# EAGLE design Ethernet Phy 4 esp32 (EAGLE 9.3.2)
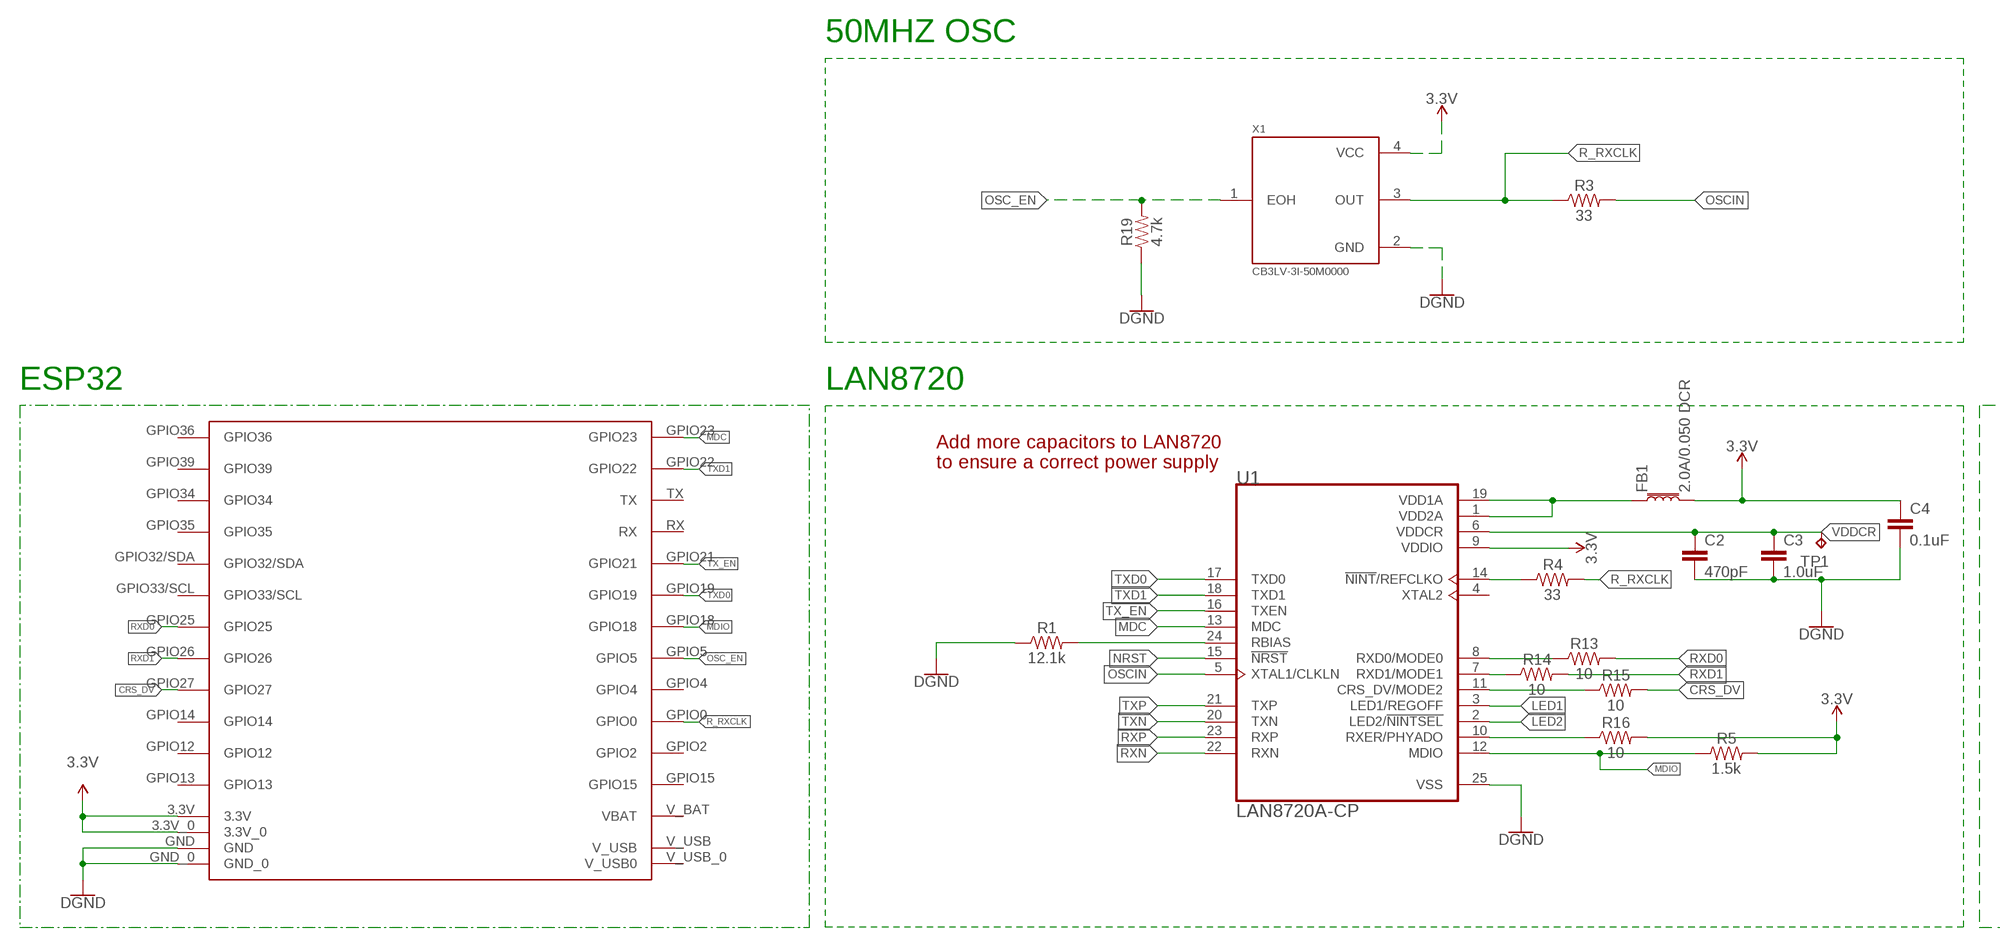
[diagram p0: schematic, sheet 1, part 1 of 2]
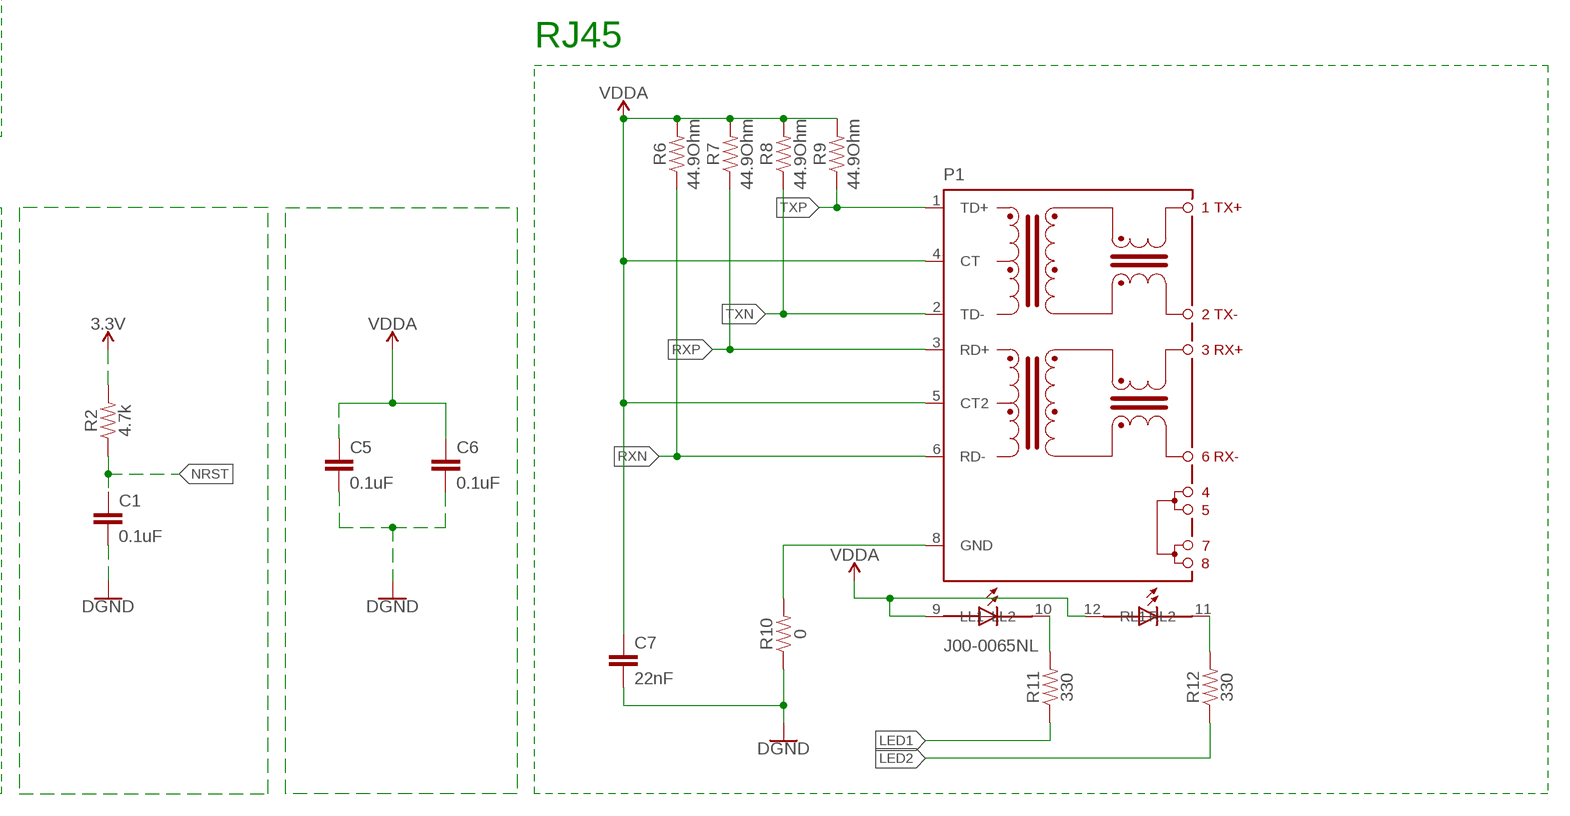
[diagram p1: schematic, sheet 1, part 2 of 2]

## Parts
C1  0.1uF  0.1UF-0603-100V-10%  [0603]
C2  470pF  470PF-0603-50V-5%  [0603]
C3  1.0uF  1.0UF-0603-16V-10%  [0603]
C4  0.1uF  0.1UF-0603-100V-10%  [0603]
C5  0.1uF  0.1UF-0603-25V-(+80/-20%)  [0603]
C6  0.1uF  0.1UF-0603-25V-(+80/-20%)  [0603]
C7  22nF  22NF/22,000PF-0603-50V-10%  [0603]
FB1  2.0A/0.050 DCR  FERRITE_BEAD-0603  [0603]
P1  J00-0065NL  [PULSE_J00-0065NL]
R1  12.1k  12.1KOHM-0603-1/10W-1%  [0603]
R2  4.7k  4.7KOHM-0603-1/10W-1%  [0603]
R3  33  33OHM-0603-1/10W-1%  [0603]
R4  33  33OHM-0603-1/10W-1%  [0603]
R5  1.5k  1.5KOHM-0603-1/10W-1%  [0603]
R6  44.9Ohm  43KOHM-0603-1/10W-1%  [0603]
R7  44.9Ohm  43KOHM-0603-1/10W-1%  [0603]
R8  44.9Ohm  43KOHM-0603-1/10W-1%  [0603]
R9  44.9Ohm  43KOHM-0603-1/10W-1%  [0603]
R10  0  0OHM-0603-1/10W-5%  [0603]
R11  330  330OHM-0603-1/10W-1%  [0603]
R12  330  330OHM-0603-1/10W-1%  [0603]
R13  10  10OHM-0603-1/10W-1%  [0603]
R14  10  10OHM-0603-1/10W-1%  [0603]
R15  10  10OHM-0603-1/10W-1%  [0603]
R16  10  10OHM-0603-1/10W-1%  [0603]
R19  4.7k  4.7KOHM-0603-1/10W-1%  [0603]
TP1  TPB1,27  [B1,27]
U1  LAN8720A-CP  [QFN50P400X400X100-25N]
U$4  OSIBOARD  [OSIBOARD]
X1  CB3LV-3I-50M0000  [OSCCC700X500X180-4N]

## Nets
3.3V: C4.1 FB1.2 R2.2 R5.2 R16.2 U1.9(VDDIO) U$4.3.3V U$4.3.3V_0 X1.4(VCC)
CRS_DV: R15.2 U$4.GPIO27
GND: C1.2 C2.2 C3.2 C4.2 C5.2 C6.2 C7.2 R1.1 R10.1 R19.1 U1.25(VSS) U$4.GND U$4.GND_0 X1.2(GND) ; supply symbol labelled DGND
LED1: R11.1 U1.3(LED1/REGOFF)
LED2: R12.1 U1.2(LED2/!NINTSEL!)
MDC: U1.13(MDC) U$4.GPIO23
MDIO: R5.1 U1.12(MDIO) U$4.GPIO18
N$4: R1.2 U1.24(RBIAS)
N$7: R4.1 U1.14(!NINT!/REFCLKO)
N$8: FB1.1 U1.1(VDD2A) U1.19(VDD1A)
N$10: P1.10(LL2) R11.2
N$12: P1.8(GND) R10.2
N$13: P1.11(RL2) R12.2
N$14: R14.1 U1.7(RXD1/MODE1)
N$15: R13.1 U1.8(RXD0/MODE0)
N$16: R15.1 U1.11(CRS_DV/MODE2)
N$17: R16.1 U1.10(RXER/PHYADO)
NRST: C1.1 R2.1 U1.15(!NRST)
OSC_EN: R19.2 U$4.GPIO5 X1.1(EOH)
OSCIN: R3.2 U1.5(XTAL1/CLKLN)
R_RXCLK: R3.1 R4.2 U$4.GPIO0 X1.3(OUT)
RXD0: R13.2 U$4.GPIO25
RXD1: R14.2 U$4.GPIO26
RXN: P1.6(RD-) R6.1 U1.22(RXN)
RXP: P1.3(RD+) R7.1 U1.23(RXP)
TX_EN: U1.16(TXEN) U$4.GPIO21
TXD0: U1.17(TXD0) U$4.GPIO19
TXD1: U1.18(TXD1) U$4.GPIO22
TXN: P1.2(TD-) R8.1 U1.20(TXN)
TXP: P1.1(TD+) R9.1 U1.21(TXP)
VDDA: C5.1 C6.1 C7.1 P1.4(CT) P1.5(CT2) P1.9(LL1) P1.12(RL1) R6.2 R7.2 R8.2 R9.2
VDDCR: C2.1 C3.1 TP1.TP U1.6(VDDCR)
Unconnected: U1.4(XTAL2) U$4.GPIO2 U$4.GPIO4 U$4.GPIO12 U$4.GPIO13 U$4.GPIO14 U$4.GPIO15 U$4.GPIO32/SDA U$4.GPIO33/SCL U$4.GPIO34 U$4.GPIO35 U$4.GPIO36 U$4.GPIO39 U$4.RX U$4.TX U$4.V_BAT(VBAT) U$4.V_USB U$4.V_USB_0(V_USB0)

## Notes on the sheet
- 50MHZ OSC
- RJ45
- ESP32 | LAN8720
- Add more capacitors to LAN8720
  to ensure a correct power supply

## Library data of the parts
C1 C4 = SparkFun-Capacitors:0.1UF: 0.1µF ceramic capacitors A capacitor is a passive two-terminal electrical component used to store electrical energy temporarily in an electric field.; PROD_ID: CAP-08390
C2 = SparkFun-Capacitors:470PF: 470pF ceramic capacitors A capacitor is a passive two-terminal electrical component used to store electrical energy temporarily in an electric field.; PROD_ID: CAP-07884
C3 = SparkFun-Capacitors:1.0UF: 1µF ceramic capacitors A capacitor is a passive two-terminal electrical component used to store electrical energy temporarily in an electric field.; PROD_ID: CAP-00868
C5 C6 = SparkFun-Capacitors:0.1UF: 0.1µF ceramic capacitors A capacitor is a passive two-terminal electrical component used to store electrical energy temporarily in an electric field.; PROD_ID: CAP-00810
C7 = SparkFun-Capacitors:22NF/22,000PF: 0.022uF/22nF/22,000pF ceramic capacitors A capacitor is a passive two-terminal electrical component used to store electrical energy temporarily in an electric field.; PROD_ID: CAP-07885
FB1 = SparkFun-Coils:FERRITE_BEAD: Ferrite Bead (blocks, cores, rings, chokes, etc.) Inductor with layers of ferrite used to suppress high frequencies. Often used to isolate high frequency noise. SparkFun Products: IOIO-OTG - V2.2 <https://www.sparkfun.com/products/13613> SparkFun SAMD21 Mini Breakout <https://www.sparkfun.com/products/13664> SparkFun 6 Degrees of Freedom Breakout - LSM6DS3 <https://www.sparkfun.com/products/13339> SparkFun SAMD21 Dev Breakout <https://www.sparkfun.com/products/13672>; PROD_ID: NDUC-07859; VALUE: 30Ω/1.8A
P1 = J00-0065NL:J00-0065NL: Conn RJ-45 Integrated Magnetics F 8 POS 2.54mm Solder RA Thru-Hole 12 Terminal 1 Port Cat 5/Cat 6; AVAILABILITY: Good; DESCRIPTION: Conn RJ-45 Integrated Magnetics F 8 POS 2.54mm Solder RA Thru-Hole 12 Terminal 1 Port Cat 5/Cat 6; MF: Pulse Electronics; MP: J00-0065NL; PACKAGE: FakePackage u; PRICE: 4.28 USD
R1 = SparkFun-Resistors:12.1KOHM: 12.1kΩ resistor A resistor is a passive two-terminal electrical component that implements electrical resistance as a circuit element. Resistors act to reduce current flow, and, at the same time, act to lower voltage levels within circuits. - Wikipedia; PROD_ID: RES-09378
R2 R19 = SparkFun-Resistors:4.7KOHM: 4.7kΩ resistor A resistor is a passive two-terminal electrical component that implements electrical resistance as a circuit element. Resistors act to reduce current flow, and, at the same time, act to lower voltage levels within circuits. - Wikipedia; PROD_ID: RES-07857
R3 R4 = SparkFun-Resistors:33OHM: 33Ω resistor A resistor is a passive two-terminal electrical component that implements electrical resistance as a circuit element. Resistors act to reduce current flow, and, at the same time, act to lower voltage levels within circuits. - Wikipedia; PROD_ID: RES-08270
R5 = SparkFun-Resistors:1.5KOHM: 1.5kΩ resistor A resistor is a passive two-terminal electrical component that implements electrical resistance as a circuit element. Resistors act to reduce current flow, and, at the same time, act to lower voltage levels within circuits. - Wikipedia; PROD_ID: RES-08306
R6-R9 = SparkFun-Resistors:43KOHM: 43kΩ resistor A resistor is a passive two-terminal electrical component that implements electrical resistance as a circuit element. Resistors act to reduce current flow, and, at the same time, act to lower voltage levels within circuits. - Wikipedia; PROD_ID: RES-07858; VALUE: 43k
R10 = SparkFun-Resistors:0OHM: 0Ω resistor A resistor is a passive two-terminal electrical component that implements electrical resistance as a circuit element. Resistors act to reduce current flow, and, at the same time, act to lower voltage levels within circuits. - Wikipedia; PROD_ID: RES-08609
R11 R12 = SparkFun-Resistors:330OHM: 330Ω resistor A resistor is a passive two-terminal electrical component that implements electrical resistance as a circuit element. Resistors act to reduce current flow, and, at the same time, act to lower voltage levels within circuits. - Wikipedia; PROD_ID: RES-00818
R13-R16 = SparkFun-Resistors:10OHM: 10Ω resistor A resistor is a passive two-terminal electrical component that implements electrical resistance as a circuit element. Resistors act to reduce current flow, and, at the same time, act to lower voltage levels within circuits. - Wikipedia; PROD_ID: RES-12581
TP1 = testpad:TP: Test pad
U1 = LAN8720A-CP:LAN8720A-CP: LAN8720A Series 3.3 V RMII 10/100 Ethernet Transceiver Surface Mount - QFN-24; AVAILABILITY: Good; DESCRIPTION: LAN8720A Series 3.3 V RMII 10/100 Ethernet Transceiver Surface Mount - QFN-24; MF: Microchip; MP: LAN8720A-CP; PACKAGE: QFN-24 Microchip; PRICE: 1.22 USD
U$4 = OSIBOARD_FOOTPRINT:OSIBOARD
X1 = CB3LV-3I-50M0000:CB3LV-3I-50M0000: Oscillator XO 50MHz 50ppm 50pF HCMOS/TTL 55% 3.3V 4-Pin SMD T/R; AVAILABILITY: Good; DESCRIPTION: CB3LV Series 50 MHz 7 x 5 mm 3.3 V ±50 ppm SMT HCMOS/TTL Clock Oscillator; MF: CTS-Frequency; MP: CB3LV-3I-50M0000; PACKAGE: SMD-4 CTS Components; PRICE: 1.14 USD

## Board
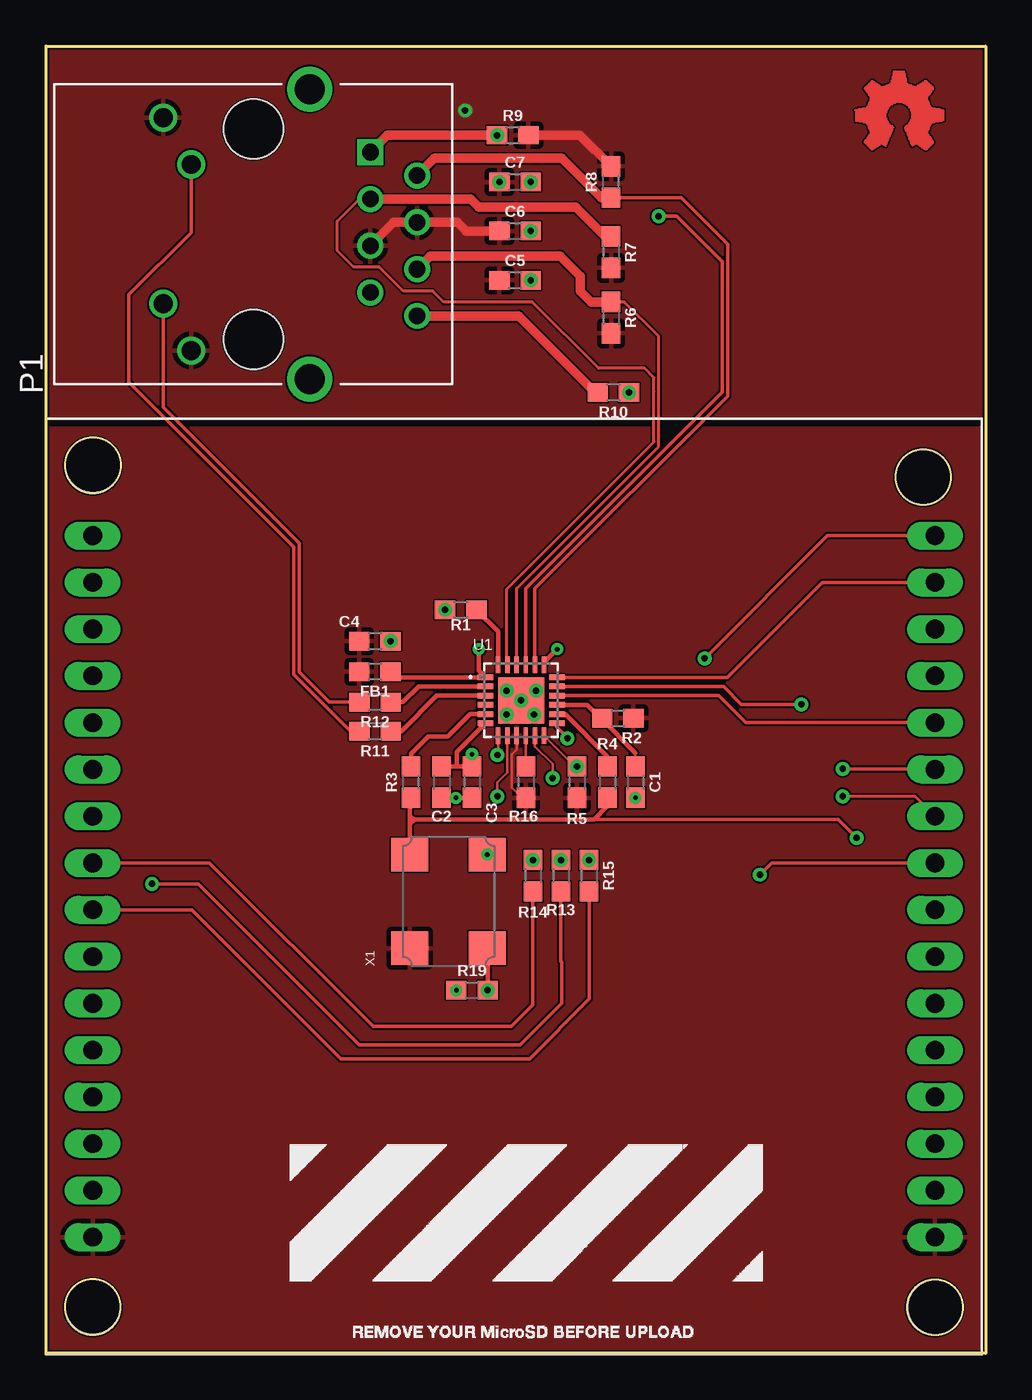
[diagram p2: board, top side]
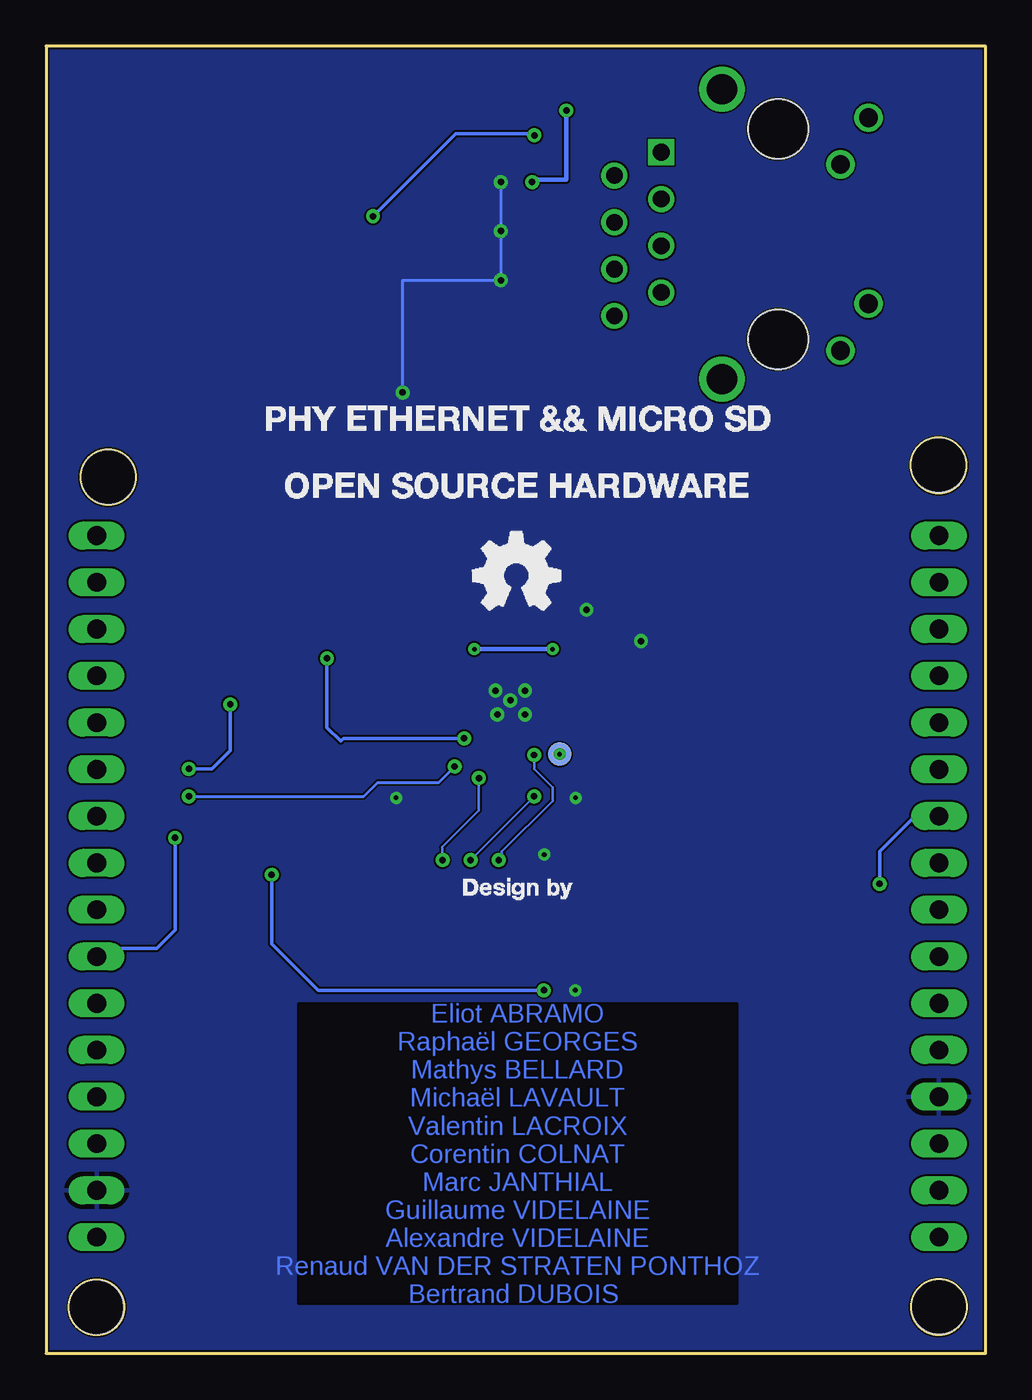
[diagram p3: board, bottom side, seen from below]

Size 51 x 71 mm. Coordinates in mm from the lower left corner, seen from the top.
Outline: 0,0 0,71 51,71 51,0 0,0
Copper layers (1*16): Top 0.035mm / dielectric 1.5mm / Bottom 0.035mm
Design rules "default *": minimum track width 0.1mm, minimum drill 0.25mm, track to track 0.1mm, track to pad 0.1mm, pad to pad 0.1mm, via to via 0.1mm, smd to smd 0mil, copper to edge 0.1mm, drill to drill 0.1mm, minimum pad ring 10mil, minimum via ring 8mil, stop-mask expansion 4mil, vias tented up to drill 0mil, thermal gap 10mil
Holes 3 mm at 2.52,2.52 48.27,2.5 47.62,47.59 2.55,48.25

### Footprints (pad centres in the part's own frame; a part is rotated, then mirrored left to right if it is on the bottom)
0603 = smd 1.1 x 1: 1 -0.85,0; 2 0.85,0
PULSE_J00-0065NL = drill 0.9 square: 1 4.445,-6.35 | drill 0.9: 2 3.175,-8.889; 3 1.905,-6.35; 4 0.635,-8.889; 5 -0.635,-6.35; 6 -1.905,-8.889; 7 -3.175,-6.35; 8 -4.445,-8.889 | drill 1.02: 9 6.325,4.9; 10 3.785,3.38; 11 -3.785,4.9; 12 -6.325,3.38 | drill 1.63: S1 7.875,-3.05; S2 -7.875,-3.05 | hole 3.25: -5.715,0; 5.715,0
B1,27 = smd 1.27 x 1.27: TP 0,0
QFN50P400X400X100-25N = smd 0.86 x 0.26: 1 -1.935,1.25; 2 -1.935,0.75; 3 -1.935,0.25; 4 -1.935,-0.25; 5 -1.935,-0.75; 6 -1.935,-1.25; 13 1.935,-1.25; 14 1.935,-0.75; 15 1.935,-0.25; 16 1.935,0.25; 17 1.935,0.75; 18 1.935,1.25 | smd 0.26 x 0.86: 7 -1.25,-1.935; 8 -0.75,-1.935; 9 -0.25,-1.935; 10 0.25,-1.935; 11 0.75,-1.935; 12 1.25,-1.935; 19 1.25,1.935; 20 0.75,1.935; 21 0.25,1.935; 22 -0.25,1.935; 23 -0.75,1.935; 24 -1.25,1.935 | smd 2.5 x 2.5: 25 0,0
OSIBOARD = drill 1.016 long: 3.3V 2.54,6.35; 3.3V_0 48.26,6.35; GND 2.54,13.97; GND_0 48.26,8.89; GND_1 48.26,13.97; GPIO0 48.26,21.59; GPIO2 48.26,19.05; GPIO4 48.26,24.13; GPIO5 48.26,26.67; GPIO12 2.54,19.05; GPIO13 2.54,16.51; GPIO14 2.54,21.59; GPIO15 48.26,16.51; GPIO18 48.26,29.21; GPIO19 48.26,31.75; GPIO21 48.26,34.29; GPIO22 48.26,41.91; GPIO23 48.26,44.45; GPIO25 2.54,29.21; GPIO26 2.54,26.67; GPIO27 2.54,24.13; GPIO32/SDA 2.54,34.29; GPIO33/SCL 2.54,31.75; GPIO34 2.54,39.37; GPIO35 2.54,36.83; GPIO36 2.54,44.45; GPIO39 2.54,41.91; RX 48.26,36.83; TX 48.26,39.37; V_BAT 2.54,8.89; V_USB 2.54,11.43; V_USB_0 48.26,11.43
OSCCC700X500X180-4N = smd 1.8 x 2: 1 -2.54,-2.1; 2 2.54,-2.1; 3 2.54,2.1; 4 -2.54,2.1

### Placement (x,y rotation side)
C1  31.99,31.03 270 top
C2  21.47,31.03 270 top
C3  23.12,31.03 270 top
C4  17.85,38.68 0 top
C5  25.46,58.28 0 top
C6  25.46,60.95 0 top
C7  25.46,63.62 0 top
FB1  17.85,37.03 180 top
P1  11.26,60.79 90 top
R1  22.51,40.38 0 top
R2  31.04,34.5 0 top
R3  19.82,31.03 90 top
R4  30.47,31.03 270 top
R5  28.82,31.03 270 top
R6  30.67,56.25 270 top
R7  30.67,59.81 270 top
R8  30.67,63.62 90 top
R9  25.34,66.16 0 top
R10  30.8,52.19 180 top
R11  17.86,33.79 180 top
R12  17.86,35.37 180 top
R13  27.95,25.95 270 top
R14  26.42,25.95 270 top
R15  29.47,25.95 270 top
R16  26.04,31.03 270 top
R19  23.12,19.72 0 top
TP1  23.12,32.55 270 bottom
U1  25.79,35.47 0 top
U$4  -0.01,-0.03 0 top
X1  21.85,24.55 90 top

### Tracks (layer width: path | path; a pad name or v marks a point on that pad's centre or on a via)
3.3V
  Top 0.127: U1.9 25.54,32.79 25.27,32.52 25.27,30.73 25.82,30.18 R16.2
  pour Top: -2,50.25 -2,-1 54,-1 54,50.25
CRS_DV
  Top 0.203: U$4.GPIO27 7.9,24.1 16,16 26.25,16 29.5,19.25 29.5,25.07 R15.2
GND  (via drill 0.25, 0.35)
  Top 0.254: C3.2 v22.25,30.18 C2.2
  Bottom 0.152: R10.1 31.65,58.28 C5.2 C6.2 C7.2
  other vias: 18.7,38.68 21.66,40.38 25.79,35.47 25,36 26.6,36 25,34.7 26.5,34.7 31.65,52.19 26.31,58.28 26.31,60.95 26.31,63.62 31.99,30.18 23.95,27.09 22.27,19.72
  pour Bottom: -3,-2 56,-2 56,50.25 -3,50.25
  pour Bottom: -1,71.5 51.5,71.5 51.5,50.15 -1,50.15
LED1
  Top 0.254: U1.3 21.22,35.72 19.29,33.79 R11.1
LED2
  Top 0.254: U1.2 20.22,36.22 19.37,35.37 R12.1
MDC  (via drill 0.35)
  Top 0.203: U1.13 27.73,34.02 28.3,33.45 v28.3,33.4 | v35.75,37.75 42.42,44.42 U$4.GPIO23
  Bottom 0.203: v28.3,33.4 34.85,33.4 35,33.25 35.75,34 v35.75,37.75
MDIO  (via drill 0.35)
  Top 0.127: U1.12 28.7,31.88 R5.1
  Top 0.152: U$4.GPIO18 47.18,30.25 v43.25,30.25
  Bottom 0.152: v43.25,30.25 33.75,30.25 33,31 29.69,31 R5.1
  other vias: 28.82,31.88
N$4
  Top 0.254: R1.2 24.54,39.21 U1.24
N$7
  Top 0.254: U1.14 28.18,34.72 30.47,32.43 R4.1
N$8  (via drill 0.25)
  Top 0.254: U1.19 27.04,37.54 v27.75,38.25 | v23.5,38.25 23.5,37.08 U1.1 19.01,36.72 18.74,36.99 FB1.1 | FB1.1
  Bottom 0.254: v27.75,38.25 v23.5,38.25
N$10
  Top 0.203: P1.10 7.88,60.88 4.5,57.5 4.5,52.75 13.45,43.8 13.45,36.87 16.54,33.79 R11.2
N$12
  Top 0.508: R10.2 29.81,52.19 25.66,56.34 P1.8
N$13
  Top 0.203: R12.2 15.38,35.37 13.75,37 13.75,44 6.36,51.4 P1.11
N$14  (via drill 0.35)
  Top 0.127: U1.7 24.54,32.54 v24.5,32.5
  Bottom 0.127: R14.1 26.25,26.97 26.25,27.25 23.5,30 23.5,30.75 24.5,31.75 v24.5,32.5
  other vias: 26.42,26.8
N$15  (via drill 0.35)
  Top 0.127: v24.5,30.25 24.5,31 25.04,31.54 25.04,32.72 25.04,32.73 U1.8
  Bottom 0.127: R13.1 v24.5,30.24 v24.5,30.25
  other vias: 27.95,26.8
N$16  (via drill 0.35)
  Top 0.127: U1.11 26.54,32.96 27.5,32 v27.5,31.25
  Bottom 0.127: v27.5,31.25 27.5,29.5 29.5,27.5 29.5,26.75 29.47,26.78 R15.1
  other vias: 29.47,26.8
N$17
  Top 0.127: R16.1 U1.10
NRST
  Top 0.127: C1.1 31.99,32.61
  Top 0.254: U1.15 29.38,35.22 30.1,34.5 | 30.1,34.5 R2.1 | 30.1,34.5 31.99,32.61
OSC_EN  (via drill 0.35)
  Top 0.203: v38.75,26 39.39,26.64 U$4.GPIO5
  Top 0.254: R19.2 23.97,21.99 X1.1
  Bottom 0.203: R19.2 36.22,19.72 38.75,22.25 v38.75,26
  other vias: 23.97,19.72
OSCIN
  Top 0.254: U1.5 23.02,34.72 21.8,33.5 20.75,33.5 19.82,32.57 R3.2
R_RXCLK  (via drill 0.35)
  Top 0.203: v44,28 43,29 29.75,29
  Top 0.254: X1.3 19.75,28.75 | 19.75,28.75 19.75,29.2 | 19.75,29.2 19.75,30.11 R3.1 | 19.75,28.75 20,29 | 20,29 29.75,29 30.47,29.72 R4.2 | 20,29 19.95,29 19.75,29.2
  Bottom 0.203: v44,28 44,23 45,22 47.81,22 U$4.GPIO0
RXD0  (via drill 0.35)
  Top 0.203: R13.2 27.95,21.3 28,21.25 28,19 25.75,16.75 17,16.75 8.25,25.5 v5.75,25.5
  Bottom 0.203: v5.75,25.5 5.75,27.25 3.82,29.18 U$4.GPIO25
RXD1
  Top 0.203: U$4.GPIO26 8.86,26.64 17.75,17.75 25.25,17.75 26.43,18.93 R14.2
RXN
  Top 0.152: U1.22 25.54,41.54 33.25,49.25 33.25,55.25 31.4,57.1 R6.1
  Top 0.508: P1.6 20.86,59.6 27.9,59.6 29,58.5 29,57.7 29.6,57.1 R6.1
RXP
  Top 0.152: U1.23 25,37.45 25,41.5 33,49.5 33,52.25 33,53 32.5,53.5 30,53.5 26.4,57.1 21.6,57.1 21,57.7 19.4,57.7 18.1,59 16.7,59 15.8,59.9 15.8,61.5 17,62.7 P1.3
  Top 0.508: P1.3 23.05,62.7 23.5,62.25 28.75,62.25 30.34,60.66 R7.1
TX_EN
  Top 0.203: U1.16 36.53,35.72 37.99,34.26 U$4.GPIO21
TXD0  (via drill 0.35)
  Top 0.203: U1.17 36.78,36.22 37.75,35.25 v41,35.25 | v43.25,31.75 48.22,31.75 U$4.GPIO19
  Bottom 0.203: v41,35.25 41,32.75 42,31.75 v43.25,31.75
TXD1
  Top 0.203: U1.18 36.97,36.72 42.13,41.88 U$4.GPIO22
TXN
  Top 0.203: U1.20 26.54,41.54 37,52 37,60.25 34.48,62.77 R8.1
  Top 0.508: P1.2 21.08,64.9 28,64.9 30.13,62.77 R8.1
TXP  (via drill 0.35)
  Top 0.203: U1.21 26.04,41.54 36.7,52.2 36.7,59.3 34.25,61.75 v33.25,61.75
  Top 0.508: P1.1 18.53,66.16 R9.1
  Bottom 0.203: v33.25,61.75 28.75,66.25 24.64,66.25 24.55,66.16 R9.1
  other vias: 24.49,66.16
VDDA  (via drill 0.35)
  Top 0.508: C6.1 22.8,60.95 22.32,61.43 P1.4 18.88,61.43 P1.5 | R9.2 28.98,66.16 R8.2
  Bottom 0.254: C7.1 24.61,63.75 22.75,63.75 v22.75,67.5
  other vias: 24.61,63.62
  pour Top: -0.5,71.25 51.25,71.25 51.25,50.75 -0.5,50.75
VDDCR  (via drill 0.25)
  Top 0.254: 22.3,31.88 C3.1 TP1.TP | 22.3,31.88 C2.1 | U1.6 22.3,32.67 22.3,31.88
  other vias: 23.12,32.55
(copper drawn outside any net)
  shapes: Top area x185

### Text on the board
Bottom: Eliot ABRAMO / Raphaël GEORGES / Mathys BELLARD / Michaël LAVAULT / Valentin LACROIX / Corentin COLNAT / Marc JANTHIAL / Guillaume VIDELAINE / Alexandre VIDELAINE / Renaud VAN DER STRATEN PONTHOZ / Bertrand DUBOIS
bStop: Objectif Sciences International | Special Thanks To: | Eliot ABRAMO / Raphaël GEORGES / Mathys BELLARD / Michaël LAVAULT / Valentin LACROIX / Corentin COLNAT / Marc JANTHIAL / Guillaume VIDELAINE / Alexandre VIDELAINE / Renaud VAN DER STRATEN PONTHOZ / Bertrand DUBOIS / (2018)